# EAGLE design BlueBird_Sch (EAGLE 9.6.2)
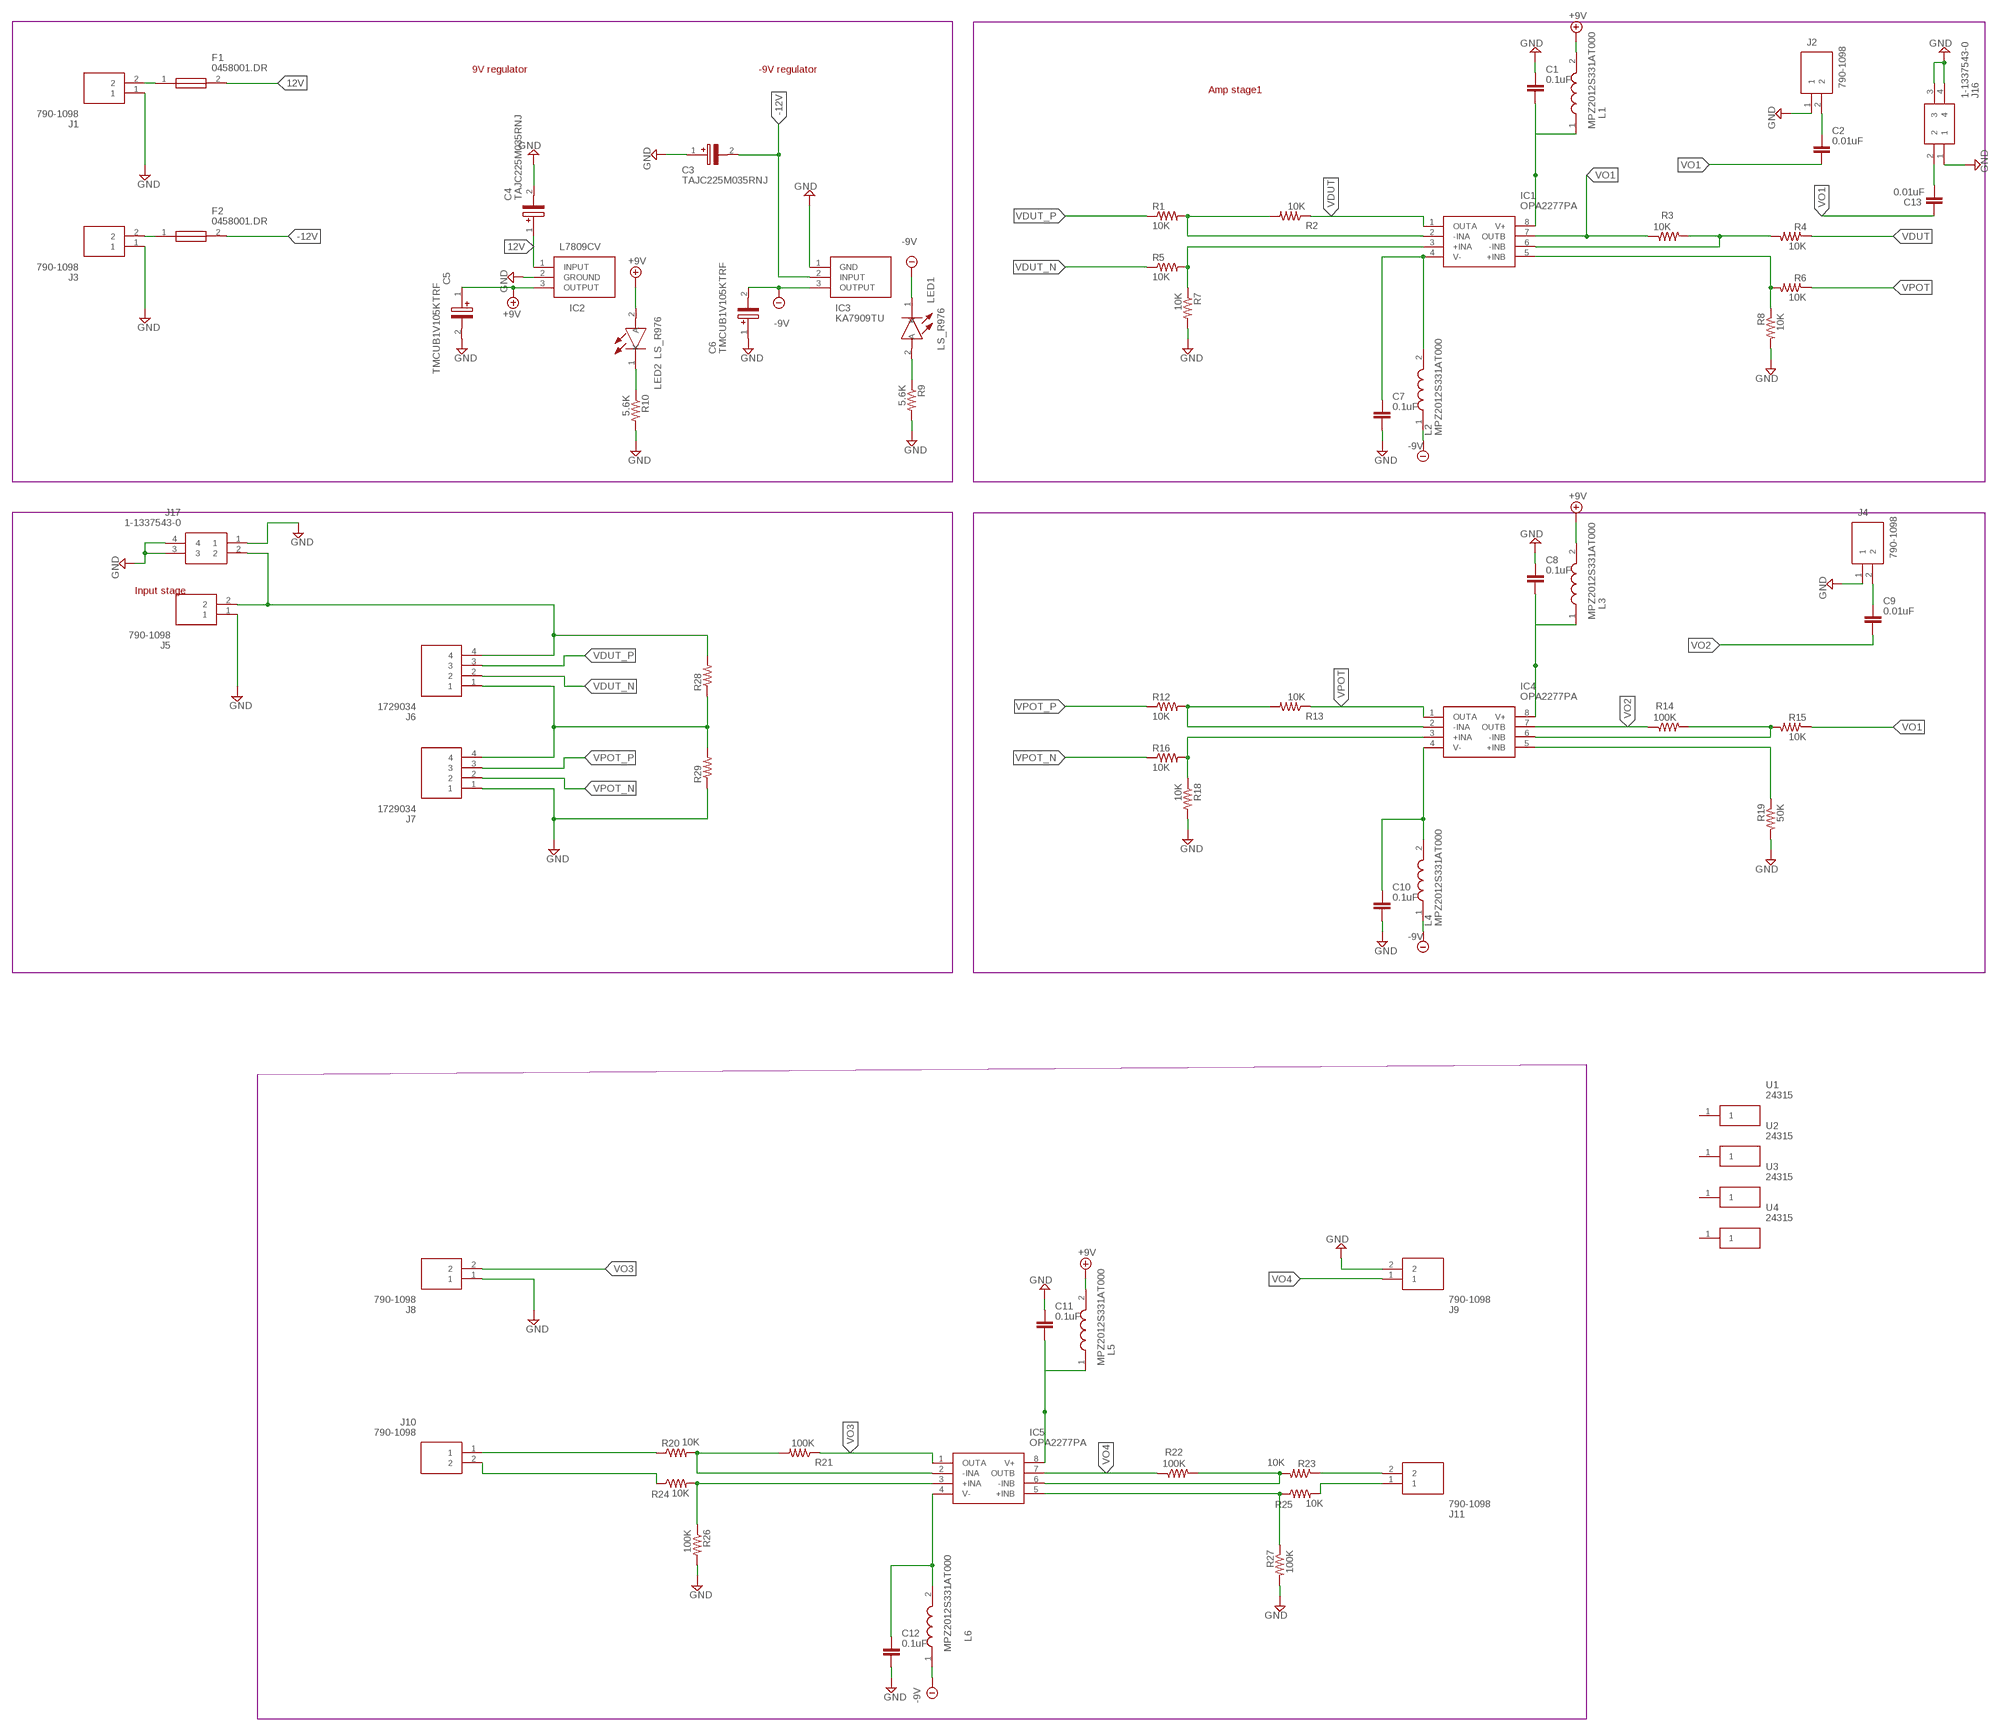
[diagram p0: schematic, sheet 1]

## Parts
C1  0.1uF  C_CHIP-0805(2012-METRIC)  [CAPC2012X110]
C2  0.01uF  C_CHIP-0805(2012-METRIC)  [CAPC2012X110]
C3  TAJC225M035RNJ  [CAPPM6032X280N]
C4  TAJC225M035RNJ  [CAPPM6032X280N]
C5  TMCUB1V105KTRF  [CAPPM3528X120N]
C6  TMCUB1V105KTRF  [CAPPM3528X120N]
C7  0.1uF  C_CHIP-0805(2012-METRIC)  [CAPC2012X110]
C8  0.1uF  C_CHIP-0805(2012-METRIC)  [CAPC2012X110]
C9  0.01uF  C_CHIP-0805(2012-METRIC)  [CAPC2012X110]
C10  0.1uF  C_CHIP-0805(2012-METRIC)  [CAPC2012X110]
C11  0.1uF  C_CHIP-0805(2012-METRIC)  [CAPC2012X110]
C12  0.1uF  C_CHIP-0805(2012-METRIC)  [CAPC2012X110]
C13  0.01uF  C_CHIP-0805(2012-METRIC)  [CAPC2012X110]
F1  0458001.DR  [FUSC3215X58N]
F2  0458001.DR  [FUSC3215X58N]
IC1  OPA2277PA  [DIP794W53P254L959H508Q8N]
IC2  L7809CV  [TO255P460X1020X2008-3P]
IC3  KA7909TU  [TO254P470X1016X2019-3P]
IC4  OPA2277PA  [DIP794W53P254L959H508Q8N]
IC5  OPA2277PA  [DIP794W53P254L959H508Q8N]
J1  790-1098  [7901098]
J2  790-1098  [7901098]
J3  790-1098  [7901098]
J4  790-1098  [7901098]
J5  790-1098  [7901098]
J6  1729034  [SHDR4W110P0X500_1X4_2000X810X1]
J7  1729034  [SHDR4W110P0X500_1X4_2000X810X1]
J8  790-1098  [7901098]
J9  790-1098  [7901098]
J10  790-1098  [7901098]
J11  790-1098  [7901098]
J16  1-1337543-0  [1-1337543-0]
J17  1-1337543-0  [1-1337543-0]
L1  MPZ2012S331AT000  [INDC2012X105N]
L2  MPZ2012S331AT000  [INDC2012X105N]
L3  MPZ2012S331AT000  [INDC2012X105N]
L4  MPZ2012S331AT000  [INDC2012X105N]
L5  MPZ2012S331AT000  [INDC2012X105N]
L6  MPZ2012S331AT000  [INDC2012X105N]
LED1  LS_R976  [LEDC2012X40N]
LED2  LS_R976  [LEDC2012X40N]
R1  10K  R-US_R0805  [R0805]
R2  10K  R-US_R0805  [R0805]
R3  10K  R-US_R0805  [R0805]
R4  10K  R-US_R0805  [R0805]
R5  10K  R-US_R0805  [R0805]
R6  10K  R-US_R0805  [R0805]
R7  10K  R-US_R0805  [R0805]
R8  10K  R-US_R0805  [R0805]
R9  5.6K  R-US_R0805  [R0805]
R10  5.6K  R-US_R0805  [R0805]
R12  10K  R-US_R0805  [R0805]
R13  10K  R-US_R0805  [R0805]
R14  100K  R-US_R0805  [R0805]
R15  10K  R-US_R0805  [R0805]
R16  10K  R-US_R0805  [R0805]
R18  10K  R-US_R0805  [R0805]
R19  50K  R-US_R0805  [R0805]
R20  10K  R-US_R0805  [R0805]
R21  100K  R-US_R0805  [R0805]
R22  100K  R-US_R0805  [R0805]
R23  10K  R-US_R0805  [R0805]
R24  10K  R-US_R0805  [R0805]
R25  10K  R-US_R0805  [R0805]
R26  100K  R-US_R0805  [R0805]
R27  100K  R-US_R0805  [R0805]
R28  R-US_R1206  [R1206]
R29  R-US_R1206  [R1206]
U1  24315  [24315]
U2  24315  [24315]
U3  24315  [24315]
U4  24315  [24315]

## Nets
12V: C4.1(+) F1.2 IC2.1(INPUT)
+9V: C5.1(+) IC2.3(OUTPUT) L1.2 L3.2 L5.2 LED2.2(A)
-9V: C6.2(-) IC3.3(OUTPUT) L2.1 L4.1 L6.1 LED1.1(K)
-12V: C3.2(-) F2.2 IC3.2(INPUT)
GND: C1.1 C3.1(+) C4.2(-) C5.2(-) C6.1(+) C7.2 C8.1 C10.2 C11.1 C12.2 IC2.2(GROUND) IC3.1(GND) J1.1 J2.1 J3.1 J4.1 J5.1 J7.1 J8.1 J9.2 J16.1 J16.3 J16.4 J17.1 J17.3 J17.4 R7.2 R8.2 R9.2 R10.2 R18.2 R19.2 R26.2 R27.2 R29.1
N$1: F1.1 J1.2
N$2: F2.1 J3.2
N$3: C7.1 IC1.4(V-) L2.2
N$4: J10.2 R24.1
N$5: J10.1 R20.1
N$6: J5.2 J6.4 J17.2 R28.2
N$7: J11.2 R23.1
N$8: J11.1 R25.2
N$9: C9.1 J4.2
N$10: C2.1 J2.2
N$11: LED1.2(A) R9.1
N$12: LED2.1(K) R10.1
N$13: C13.1 J16.2
N$18: J6.1 J7.4 R28.1 R29.2
N$19: IC1.2(-INA) R1.2 R2.2
N$22: IC1.3(+INA) R5.2 R7.1
N$27: C8.2 IC4.8(V+) L3.1
N$33: C1.2 IC1.8(V+) L1.1
N$36: C11.2 IC5.8(V+) L5.1
N$37: IC1.6(-INB) R3.2 R4.2
N$38: IC1.5(+INB) R6.2 R8.1
N$39: C10.1 IC4.4(V-) L4.2
N$40: IC4.2(-INA) R12.2 R13.2
N$42: IC4.3(+INA) R16.2 R18.1
N$43: C12.1 IC5.4(V-) L6.2
N$44: IC4.6(-INB) R14.2 R15.2
N$45: IC4.5(+INB) R19.1
N$46: IC5.2(-INA) R20.2 R21.2
N$47: IC5.3(+INA) R24.2 R26.1
N$48: IC5.6(-INB) R22.2 R23.2
N$49: IC5.5(+INB) R25.1 R27.1
VDUT: IC1.1(OUTA) R2.1 R4.1
VDUT_N: J6.2 R5.1
VDUT_P: J6.3 R1.1
VO1: C2.2 C13.2 IC1.7(OUTB) R3.1 R15.1
VO2: C9.2 IC4.7(OUTB) R14.1
VO3: IC5.1(OUTA) J8.2 R21.1
VO4: IC5.7(OUTB) J9.1 R22.1
VPOT: IC4.1(OUTA) R6.1 R13.1
VPOT_N: J7.2 R16.1
VPOT_P: J7.3 R12.1
Unconnected: U1.1 U2.1 U3.1 U4.1

## Notes on the sheet
- 9V regulator | -9V regulator
- Amp stage1
- Input stage

## Library data of the parts
C1 C2 C7-C13 = Capacitor:C: Capacitor - Generic; CATEGORY: Capacitor
C3 C4 = SamacSys_Parts:TAJC225M035RNJ: Tantalum Capacitors - Solid SMD 35volts 2.2uF 20% Source: Datasheet <http://uk.rs-online.com/web/p/products/1364458P>; DESCRIPTION: Tantalum Capacitors - Solid SMD 35volts 2.2uF 20%; HEIGHT: 2.8mm; MANUFACTURER_NAME: AVX; MANUFACTURER_PART_NUMBER: TAJC225M035RNJ; RS_PART_NUMBER: 1364458P; RS_PRICE-STOCK: http://uk.rs-online.com/web/p/products/1364458P
C5 C6 = SamacSys_Parts:TMCUB1V105KTRF: Cap Tant Solid 1uF 35V UB CASE 10% (3.5 X 2.8 X 1.2mm) Inward L SMD 3528-12 8.8 Ohm 125C T/R Source: Datasheet <http://uk.rs-online.com/web/p/products/1882061>; DESCRIPTION: Cap Tant Solid 1uF 35V UB CASE 10% (3.5 X 2.8 X 1.2mm) Inward L SMD 3528-12 8.8 Ohm 125C T/R; HEIGHT: 1.2mm; MANUFACTURER_NAME: Vishay; MANUFACTURER_PART_NUMBER: TMCUB1V105KTRF; RS_PART_NUMBER: 1882061; RS_PRICE-STOCK: http://uk.rs-online.com/web/p/products/1882061
F1 F2 = SamacSys_Parts:0458001.DR: LITTELFUSE - 0458001.DR - Fuse, Surface Mount, 1 A, 48 VAC, 63 VDC, Very Fast Acting, 1206 Source: Datasheet <https://rs.componentsearchengine.com/Datasheets/2/0458001.DR.pdf>; DESCRIPTION: LITTELFUSE - 0458001.DR - Fuse, Surface Mount, 1 A, 48 VAC, 63 VDC, Very Fast Acting, 1206; HEIGHT: 0.58mm; MANUFACTURER_NAME: LITTELFUSE; MANUFACTURER_PART_NUMBER: 0458001.DR
IC1 IC4 IC5 = SamacSys_Parts:OPA2277PA: Dual precision op-amp,OPA2277PA DIP8 Texas Instruments OPA2277PA, Dual Op Amp, 1MHz, 8-Pin PDIP Source: Datasheet <http://uk.rs-online.com/web/p/products/3071673P>; DESCRIPTION: Dual precision op-amp,OPA2277PA DIP8 Texas Instruments OPA2277PA, Dual Op Amp, 1MHz, 8-Pin PDIP; HEIGHT: 5.08mm; MANUFACTURER_NAME: Texas Instruments; MANUFACTURER_PART_NUMBER: OPA2277PA; RS_PART_NUMBER: 3071673P; RS_PRICE-STOCK: http://uk.rs-online.com/web/p/products/3071673P
IC2 = SamacSys_Parts:L7809CV: Standard Regulator 9V 1.5A STMicroelectronics L7809CV, Single Linear Voltage Regulator, 1.5A 9 V, 2%, 3-Pin TO-220 Source: Datasheet <http://uk.rs-online.com/web/p/products/7140666P>; ALLIED_NUMBER: 70013895; DESCRIPTION: Standard Regulator 9V 1.5A STMicroelectronics L7809CV, Single Linear Voltage Regulator, 1.5A 9 V, 2%, 3-Pin TO-220; HEIGHT: 4.6mm; MANUFACTURER_NAME: STMicroelectronics; MANUFACTURER_PART_NUMBER: L7809CV; RS_PART_NUMBER: 7140666P; RS_PRICE-STOCK: http://uk.rs-online.com/web/p/products/7140666P
IC3 = SamacSys_Parts:KA7909TU: ON Semiconductor, -9 V Linear Voltage Regulator, 1A, 1-Channel Negative, +/-4% 3-Pin, TO-220 KA7909TU Source: Datasheet <http://uk.rs-online.com/web/p/products/7390552P>; DESCRIPTION: ON Semiconductor, -9 V Linear Voltage Regulator, 1A, 1-Channel Negative, +/-4% 3-Pin, TO-220 KA7909TU; HEIGHT: 4.7mm; MANUFACTURER_NAME: ON Semiconductor; MANUFACTURER_PART_NUMBER: KA7909TU; RS_PART_NUMBER: 7390552P; RS_PRICE-STOCK: http://uk.rs-online.com/web/p/products/7390552P
J1-J5 J8-J11 = SamacSys_Parts:790-1098: 2 Way PCB Terminal Strip Source: Datasheet; DESCRIPTION: 2 Way PCB Terminal Strip; HEIGHT: 8.5mm; MANUFACTURER_NAME: RS Components; MANUFACTURER_PART_NUMBER: 790-1098
J6 J7 = SamacSys_Parts:1729034: Low profile PCB terminal block,5mm,4 way Phoenix Contact COMBICON MKDSN Series 5mm Pitch Straight PCB Terminal Block with Screw Termination, Through Hole, 4 Way Source: Datasheet <http://uk.rs-online.com/web/p/products/8020620>; ALLIED_NUMBER: 70054377; DESCRIPTION: Low profile PCB terminal block,5mm,4 way Phoenix Contact COMBICON MKDSN Series 5mm Pitch Straight PCB Terminal Block with Screw Termination, Through Hole, 4 Way; HEIGHT: 10mm; MANUFACTURER_NAME: Phoenix Contact; MANUFACTURER_PART_NUMBER: 1729034; RS_PART_NUMBER: 8020620; RS_PRICE-STOCK: http://uk.rs-online.com/web/p/products/8020620
J16 J17 = SamacSys_Parts:1-1337543-0: BNC Ins R/A PCB Skt 50Ohm White Source: Datasheet <http://uk.rs-online.com/web/p/products/5121225P>; ALLIED_NUMBER: 70084602; DESCRIPTION: BNC Ins R/A PCB Skt 50Ohm White; HEIGHT: mm; MANUFACTURER_NAME: TE Connectivity; MANUFACTURER_PART_NUMBER: 1-1337543-0; RS_PART_NUMBER: 5121225P; RS_PRICE-STOCK: http://uk.rs-online.com/web/p/products/5121225P
L1-L6 = SamacSys_Parts:MPZ2012S331AT000: Ferrite Beads Multi-Layer Power 330Ohm 25% 100MHz 2.5A 50mOhm DCR 0805 T/R Source: Datasheet <https://product.tdk.com/info/en/catalog/datasheets/beads_commercial_power_mpz2012_en.pdf>; DESCRIPTION: Ferrite Beads Multi-Layer Power 330Ohm 25% 100MHz 2.5A 50mOhm DCR 0805 T/R; HEIGHT: 1.05mm; MANUFACTURER_NAME: TDK; MANUFACTURER_PART_NUMBER: MPZ2012S331AT000
LED1 LED2 = SamacSys_Parts:LS_R976: Red 0805 CHIPLED LS R976N-R102 Osram Opto LS R976, CHIPLED 0805 Series Red LED, 633 nm, 2012 (0805), Rectangle Lens SMD Package Source: Datasheet <http://uk.rs-online.com/web/p/products/4974804P>; DESCRIPTION: Red 0805 CHIPLED LS R976N-R102 Osram Opto LS R976, CHIPLED 0805 Series Red LED, 633 nm, 2012 (0805), Rectangle Lens SMD Package; HEIGHT: 0.4mm; MANUFACTURER_NAME: OSRAM; MANUFACTURER_PART_NUMBER: LS R976; RS_PART_NUMBER: 4974804P; RS_PRICE-STOCK: http://uk.rs-online.com/web/p/products/4974804P
R1-R10 R12-R16 R18-R29 = resistor:R-US_: RESISTOR, American symbol
U1-U4 = SamacSys_Parts:24315: SPACER/STANDOFF, HEX, BRASS, 15MM; Standoff Material:Brass; Thread Size - Metric:M3; Thread Size - Imperial:-; Standoff Type:Hex Male-Female; Body Length:15mm; Overall Length:23mm; External Width:5mm; Product Range:Hex Brass Series RoHS Compliant: Yes Source: Datasheet <http://keyelco.com/userAssets/file/M65p76.pdf>; ALLIED_NUMBER: 70182188; DESCRIPTION: SPACER/STANDOFF, HEX, BRASS, 15MM; Standoff Material:Brass; Thread Size - Metric:M3; Thread Size - Imperial:-; Standoff Type:Hex Male-Female; Body Length:15mm; Overall Length:23mm; External Width:5mm; Product Range:Hex Brass Series RoHS Compliant: Yes; HEIGHT: 15mm; MANUFACTURER_NAME: Keystone Electronics; MANUFACTURER_PART_NUMBER: 24315

## Board
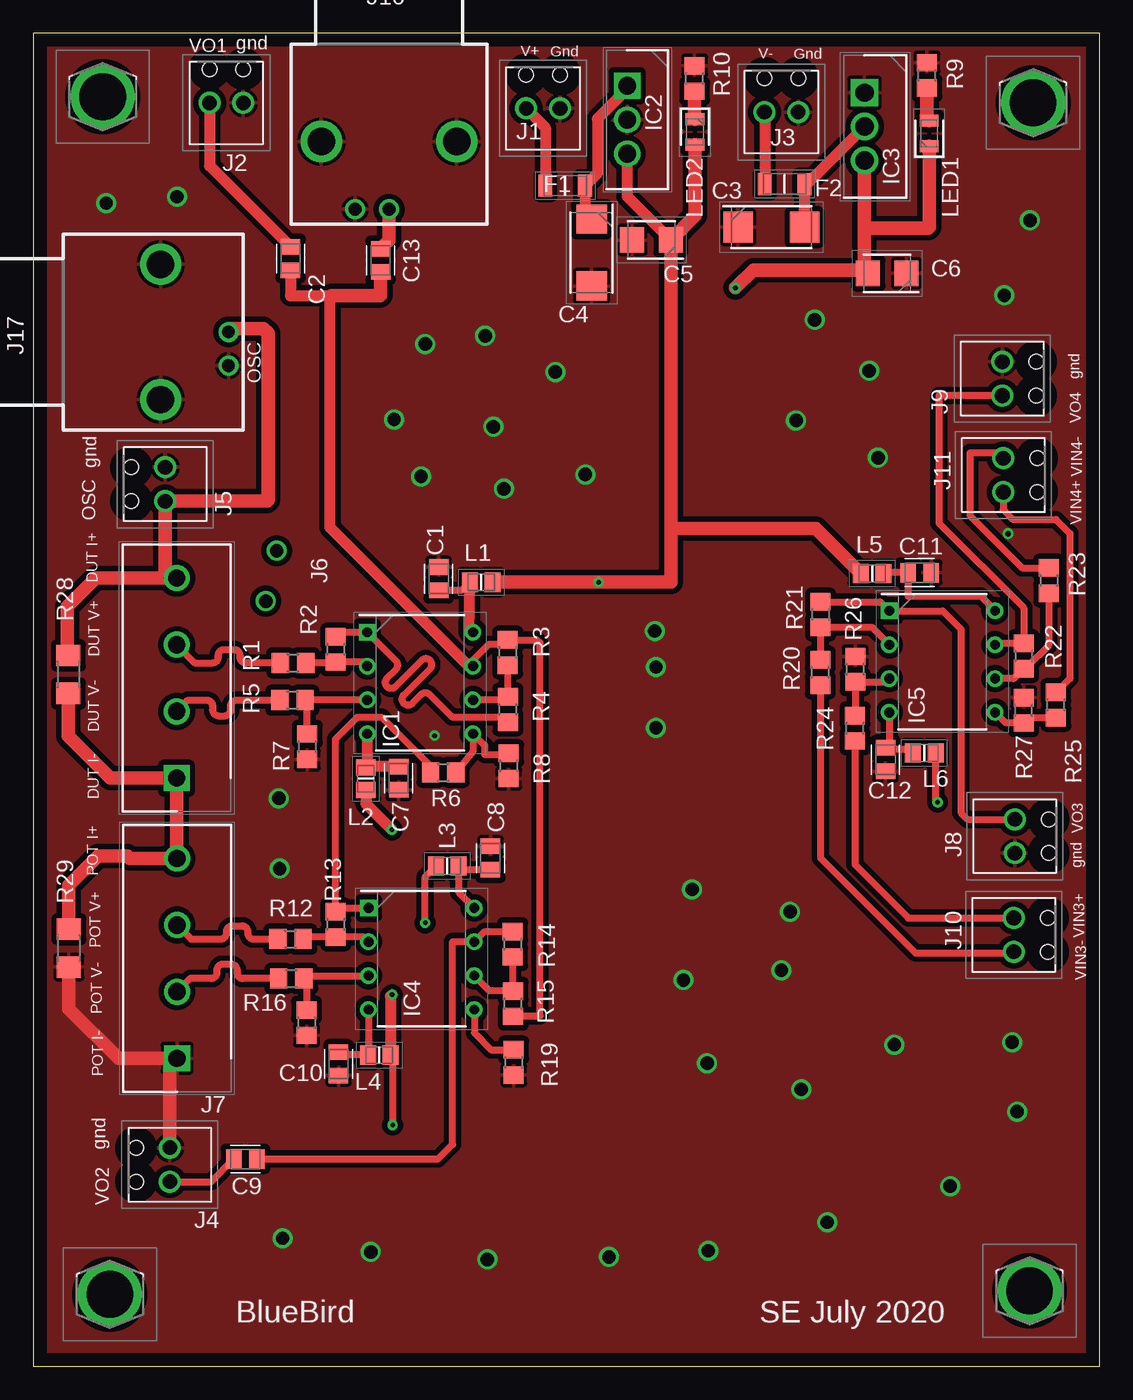
[diagram p1: board, top side]
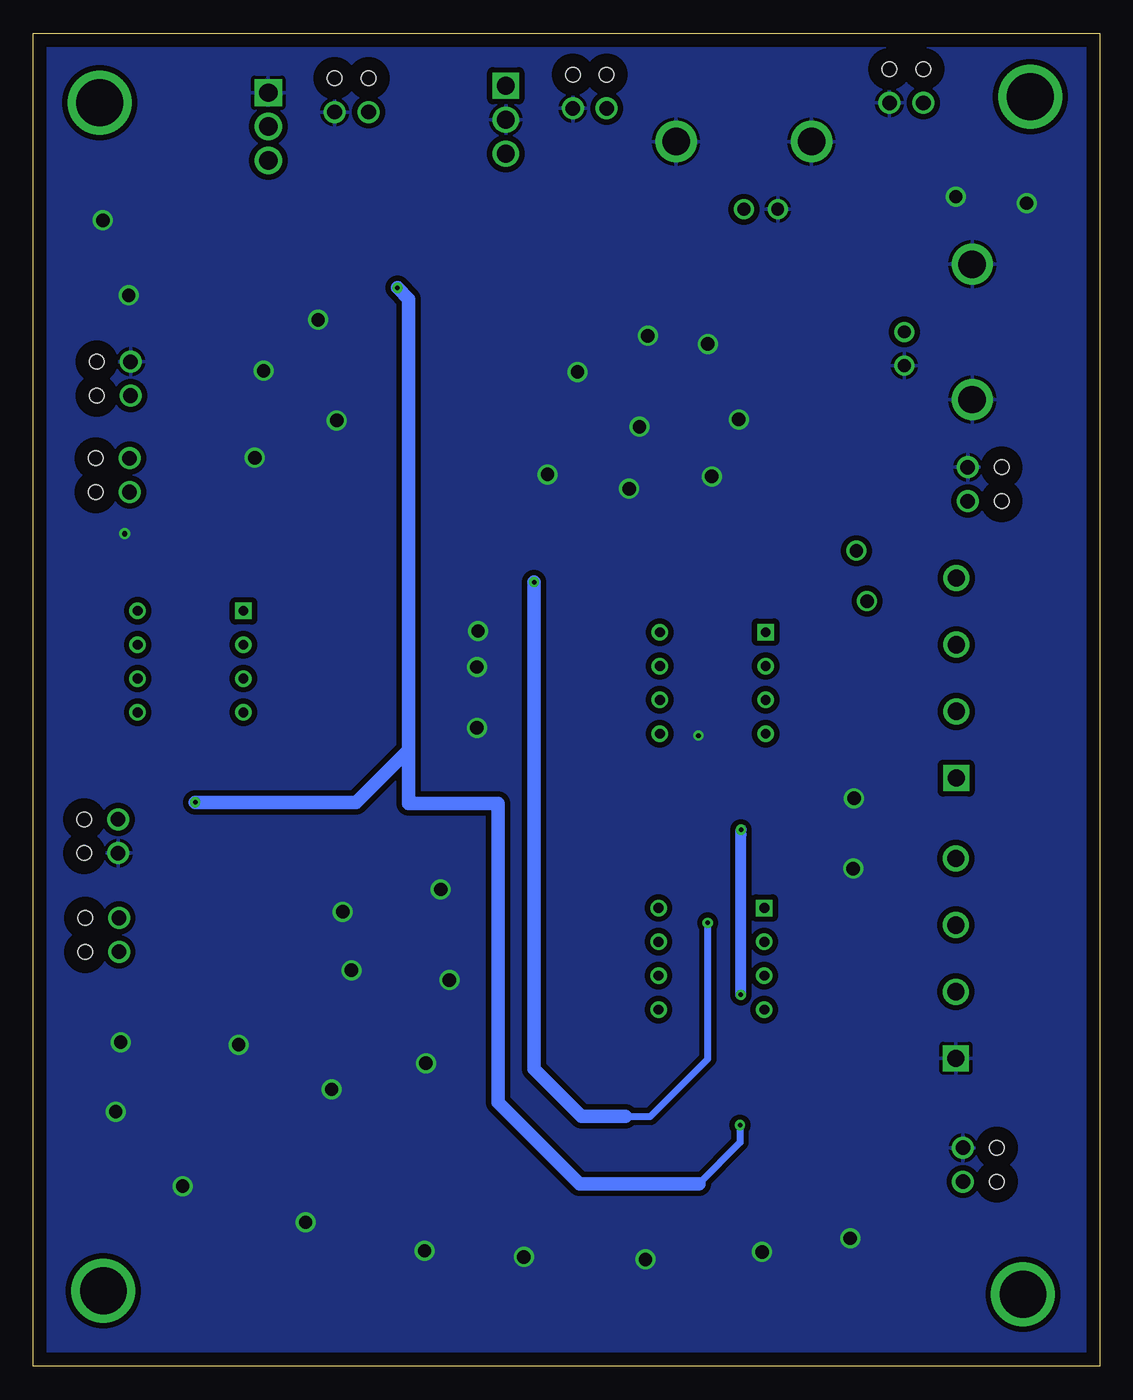
[diagram p2: board, bottom side, seen from below]

Size 80 x 100 mm. Coordinates in mm from the lower left corner, seen from the top.
Outline: 0,0 80,0 80,100 0,100 0,0
Copper layers (1*16): Top 0.07mm / dielectric 1.5mm / Bottom 0.07mm
Design rules "default *": minimum track width 6mil, minimum drill 0.35mm, track to track 6mil, track to pad 6mil, pad to pad 6mil, via to via 6mil, smd to smd 6mil, copper to edge 40mil, drill to drill 6mil, minimum pad ring 10mil, minimum via ring 8mil, stop-mask expansion 4mil, vias tented up to drill 0mil, thermal gap 10mil

### Footprints (pad centres in the part's own frame; a part is rotated, then mirrored left to right if it is on the bottom)
CAPC2012X110 = smd 1.165 x 1.465: 1 -0.875,0; 2 0.875,0
CAPPM6032X280N = smd 2.2 x 2.3: 1 -2.5,0; 2 2.5,0
CAPPM3528X120N = smd 1.8 x 1.9: 1 -1.45,0; 2 1.45,0
FUSC3215X58N = smd 1.02 x 1.63: 1 -1.485,0; 2 1.485,0
DIP794W53P254L959H508Q8N = drill 0.73 pad 1.13 square: 1 -3.97,3.81 | drill 0.73 pad 1.13: 2 -3.97,1.27; 3 -3.97,-1.27; 4 -3.97,-3.81; 5 3.97,-3.81; 6 3.97,-1.27; 7 3.97,1.27; 8 3.97,3.81
TO255P460X1020X2008-3P = drill 1.32 pad 1.98 square: 1 0,0 | drill 1.32 pad 1.98: 2 2.55,0; 3 5.1,0
TO254P470X1016X2019-3P = drill 1.37 pad 2.055 square: 1 0,0 | drill 1.37 pad 2.055: 2 2.535,0; 3 5.07,0
7901098 = drill 1.1 pad 1.65: 1 0,0; 2 2.54,0 | hole 1.1: 0,-2.54; 2.54,-2.54
SHDR4W110P0X500_1X4_2000X810X1 = drill 1.3 pad 1.95 square: 1 0,0 | drill 1.3 pad 1.95: 2 5,0; 3 10,0; 4 15,0
1-1337543-0 = drill 0.97 pad 1.5: 1 -2.54,1.112; 2 0,1.112 | drill 2.06 pad 3.1: 3 5.08,6.2; 4 -5.08,6.2
INDC2012X105N = smd 1.2 x 1.45: 1 -0.85,0; 2 0.85,0
LEDC2012X40N = smd 0.9 x 1.4: 1 -0.95,0; 2 0.95,0
R0805 = smd 1.3 x 1.5: 1 -0.95,0; 2 0.95,0
R1206 = smd 1.6 x 1.803: 1 -1.422,0; 2 1.422,0
24315 = drill 3.5 pad 4.8: 1 0,0

### Placement (x,y rotation side)
C1  30.42,59.08 270 top
C2  19.3,83.1 270 top
C3  55.38,85.46 0 top
C4  41.89,83.55 270 top
C5  46.38,84.5 180 top
C6  64.07,82 180 top
C7  27.41,44.11 270 top
C8  34.3,38.12 270 top
C9  15.91,15.54 0 top
C10  22.9,22.68 270 top
C11  66.5,59.53 180 top
C12  63.94,45.51 270 top
C13  26.06,82.96 270 top
F1  39.91,88.57 0 top
F2  56.37,88.69 0 top
IC1  29.02,51.26 0 top
IC2  44.55,96.07 270 top
IC3  62.37,95.54 270 top
IC4  29.12,30.57 0 top
IC5  68.2,52.86 0 top
J1  39.52,94.37 180 top
J2  15.76,94.78 180 top
J3  57.39,94.1 180 top
J4  10.24,16.39 270 top
J5  9.89,67.44 270 top
J6  10.75,44.13 90 top
J7  10.78,23.1 90 top
J8  73.64,38.49 90 top
J9  72.7,72.82 90 top
J10  73.57,31.09 90 top
J11  72.78,65.58 90 top
J16  26.69,85.68 0 top
J17  15.75,77.6 90 top
L1  33.6,58.82 0 top
L2  24.96,44.08 90 top
L3  31.06,37.53 180 top
L4  25.95,23.34 180 top
L5  62.94,59.47 180 top
L6  66.85,46.01 180 top
LED1  67.22,92.49 90 top
LED2  49.64,92.61 270 top
R1  19.49,52.76 0 top
R2  22.69,53.78 270 top
R3  35.59,53.55 270 top
R4  35.61,49.27 90 top
R5  19.44,49.97 0 top
R6  30.75,44.56 0 top
R7  20.55,46.48 270 top
R8  35.67,45.04 270 top
R9  67.05,96.85 90 top
R10  49.62,96.61 90 top
R12  19.29,32.04 0 top
R13  22.69,33.15 270 top
R14  35.97,31.66 270 top
R15  36,27.2 90 top
R16  19.36,29.08 0 top
R18  20.5,25.77 270 top
R19  36.04,22.79 270 top
R20  59.05,52.05 90 top
R21  59.06,56.4 270 top
R22  74.3,53.28 270 top
R23  76.18,58.95 270 top
R24  61.65,47.86 90 top
R25  76.73,49.61 90 top
R26  61.67,52.29 90 top
R27  74.3,49.21 90 top
R28  2.63,51.9 90 top
R29  2.66,31.37 90 top
U1  5.74,5.4 0 top
U2  74.75,5.66 0 top
U3  75.02,94.8 0 top
U4  5.2,95.24 0 top

### Tracks (layer width: path | path; a pad name or v marks a point on that pad's centre or on a via)
12V
  Top 0.813: IC2.1 44.55,95.81 42.31,93.58 42.31,89.49 F1.2 41.4,86.11 C4.1
+9V  (via drill 0.35)
  Top 0.508: v29.4,33.27 29.4,36.72 L3.2
  Top 0.813: C5.1 44.55,87.78 IC2.3
  Top 1.016: LED2.2 49.64,86.31 C5.1 47.83,62.85 | 47.83,62.85 47.83,58.82 v42.42,58.82 L1.2 | L5.2 58.71,62.85 47.83,62.85
  Bottom 0.508: 35.56,18.74 33.7,18.74 29.4,23.04 v29.4,33.27
  Bottom 1.016: v42.42,58.82 42.42,22.3 38.86,18.74 35.56,18.74
-9V  (via drill 0.35)
  Top 0.508: v67.85,42.31 67.7,42.46 L6.1 | L4.1 26.97,23.17 v26.97,18.09
  Top 0.813: L2.1 24.96,42.19 v26.9,40.25 | v26.92,27.87 26.8,27.75 L4.1
  Top 1.016: IC3.3 62.37,85.55 | 62.37,85.55 62.37,82.25 | 62.37,82.25 C6.2 | 62.37,85.55 62.53,85.39 67.14,85.39 67.22,85.47 LED1.1 | v52.68,80.9 54.03,82.25 62.37,82.25
  Bottom 0.508: v26.97,18.09 26.97,16.79 30.07,13.69
  Bottom 0.813: v26.92,27.87 26.92,39.85 26.9,39.87 v26.9,40.25
  Bottom 1.016: 30.07,13.69 39.01,13.69 45.13,19.81 45.13,42.22 51.83,42.22 51.83,46.25 | v52.68,80.9 51.83,80.05 51.83,46.25 | v67.85,42.31 55.77,42.31 51.83,46.25
-12V
  Top 0.813: IC3.2 58.05,88.69 F2.2 57.85,86.74 C3.2
GND  (via drill 0.35, 0.4, 1)
  Top 0.508: 10.76,23.08 J7.1
  Top 1.016: R29.1 2.66,26.82 6.4,23.08 10.76,23.08 10.24,22.56 J4.1
  other vias: 73.14,62.46 18.71,9.59 25.32,8.57 34.07,8.01 43.19,8.2 50.64,8.66 59.57,10.8 68.79,13.51 73.82,19.09 73.44,24.31 64.6,24.12 57.62,20.77 50.55,22.73 48.78,28.97 49.43,35.77 56.13,29.71 56.78,34.09 46.72,47.89 46.72,52.46 46.63,55.16 41.42,66.91 35.3,65.83 34.52,70.48 27.07,71.03 29.09,66.76 39.17,74.6 29.4,76.69 33.9,77.31 57.23,70.95 63.38,68.16 62.72,74.68 58.63,78.51 72.85,80.34 74.78,85.97 5.47,87.26 10.78,87.74 18.48,37.33 18.42,42.61 30.1,47.31
  pour Top (isolate 0.406): -5,105 -5,-10 85,-10 85,105
  pour Bottom (isolate 0.406): -22,102 -22,-12 90,-12 90,102
N$1
  Top 0.813: J1.2 38.42,92.92 F1.1
N$2
  Top 0.813: J3.2 54.88,94.06 F2.1
N$3
  Top 0.813: C7.1 25.02,44.98 | 25.02,44.98 L2.2 | IC1.4 25.05,45.02 25.02,44.98
N$4
  Top 0.508: R24.1 61.65,37.63 65.65,33.63 J10.2
N$5
  Top 0.508: R20.1 59.06,38.12 66.19,30.99 73.47,30.99 J10.1
N$6
  Top 1.016: J6.4 9.83,59.13 | 9.83,59.13 4.69,59.13 2.54,56.98 2.54,53.41 R28.2 | 9.83,59.13 9.89,59.19 J5.2 17.54,64.9 17.61,64.97 17.61,77.49 17.24,77.86 14.9,77.86 J17.2
N$7
  Top 0.508: J11.2 72.78,68.54 70.28,68.54 70.28,63.83 74.2,59.9 R23.1
N$8
  Top 0.508: J11.1 72.77,64.26 73.51,63.52 76.72,63.52 77.77,62.47 77.77,51.58 76.75,50.56 76.75,50.28 R25.2
N$9
  Top 0.508: J4.2 13.35,13.85 C9.1
N$10
  Top 0.813: C2.1 13.22,90.06 J2.2
N$11
  Top 1.016: R9.1 67.05,93.61 LED1.2
N$12
  Top 1.016: R10.1 49.62,93.58 LED2.1
N$13
  Top 1.016: J16.2 26.69,84.47 C13.1
N$14  (via drill 1)
  other vias: 18.25,61.18
N$15  (via drill 1)
  other vias: 17.44,57.4
N$18
  Top 1.016: R28.1 2.63,47.27 5.77,44.13 J6.1 10.75,38.13 J7.4 7.22,38.1 7.04,38.28 4.88,38.28 2.66,36.06 R29.2
N$19
  Top 0.508: 22.62,52.76 R1.2 | R2.2 24.75,52.83 IC1.2
  Top 1.016: 22.62,52.76 R2.2
N$22
  Top 0.508: IC1.3 25.03,49.97 R5.2 20.55,49.81 R7.1
N$27
  Top 0.508: C8.2 32.2,37.24 L3.1 31.91,35.56 IC4.8
N$33
  Top 0.508: L1.1 32.13,58.2 C1.2
  Top 0.813: IC1.8 32.71,55.07 L1.1
N$36
  Top 0.508: IC5.8 71.08,57.78 65.62,57.78 C11.2 63.85,59.53 L5.1
N$37
  Top 0.508: IC1.6 35.38,49.99 R4.2 35.59,50.24 R3.2
N$38
  Top 0.508: R6.2 32.99,46.11 IC1.5 33.86,46.58 33.86,45.89 35.57,45.89 R8.1
N$39
  Top 0.508: IC4.4 25.15,23.39 L4.2 23.11,23.34 C10.1
N$40
  Top 0.508: R12.2 20.4,32.2 R13.2 24.79,32.2 IC4.2
N$42
  Top 0.508: R18.1 20.5,28.89 R16.2 20.53,29.3 IC4.3
N$43
  Top 0.508: IC5.4 64.23,46.67 C12.1 64.06,46.27 65.74,46.27 L6.2
N$44
  Top 0.508: 35.97,28.18 R15.2 | IC4.6 34.21,28.18 35.97,28.18 | R14.2 35.97,28.18
N$45
  Top 0.508: IC4.5 33.09,25.01 34.36,23.74 R19.1
N$46
  Top 0.508: IC5.2 62.91,55.45 R21.2 R20.2
N$47
  Top 0.508: IC5.3 63.98,51.34 R26.1 61.67,48.83 R24.2
N$48
  Top 0.508: IC5.6 73.56,51.59 R22.2 74.52,52.41 76.18,54.07 R23.2
N$49
  Top 0.508: R25.1 74.7,48.66 R27.1 72.96,48.26 IC5.5
VDUT
  Top 0.508: R4.1 35.21,48.72 31.4,48.72 29.73,50.39 arc90 29.1,50.39 28.43,49.72 arc-90 27.8,49.72 27.8,49.72 arc-90 27.8,50.35 29.77,52.32 arc90 29.77,52.95 29.77,52.95 arc90 29.14,52.95 27.17,50.98 arc-90 26.54,50.98 26.54,50.99 arc-90 26.54,51.62 27.2,52.29 arc90 27.2,52.91 IC1.1 23.03,55.07 R2.1
VDUT_N
  Top 0.508: J6.2 11.59,49.97 13.01,49.97 arc-90 13.45,49.53 13.45,49.24 arc90 13.89,48.8 14.36,48.8 arc90 14.81,49.24 14.81,49.53 arc-90 15.25,49.97 R5.1
VDUT_P
  Top 0.508: J6.3 12.12,52.76 13.43,52.76 arc90 13.87,53.2 13.87,53.32 arc-90 14.32,53.76 15.06,53.76 arc-90 15.51,53.32 15.51,53.2 arc90 15.95,52.76 R1.1
VO1
  Top 0.508: IC1.7 32.99,52.97 34.15,54.13 35.22,54.13 R3.1 37.79,54.5 38.02,54.27 38.02,26.29 36.04,26.29 R15.1
  Top 0.813: IC1.7 32.65,52.53 22.26,62.92 22.26,80.19 | 26.01,80.31 19.3,80.31 C2.2
  Top 1.016: 22.26,80.19 22.38,80.31 26.01,80.31 26.06,80.36 C13.2
VO2
  Top 0.508: C9.2 30.36,15.54 31.46,16.64 31.46,31.86 33.07,31.86 IC4.7 33.86,32.61 R14.1
VO3
  Top 0.508: R21.1 63.55,57.35 IC5.1 68.23,56.67 69.6,55.3 69.6,41.51 70.08,41.03 J8.2
VO4
  Top 0.508: IC5.7 72.33,53.97 72.59,54.23 R22.1 74.3,56.91 67.96,63.25 67.96,72.82 J9.1
VPOT
  Top 0.508: R6.1 29.98,44.84 26.12,48.69 24.32,48.69 22.67,47.04 22.67,35.75 22.69,35.73 R13.1 22.97,34.38 IC4.1
VPOT_N
  Top 0.508: J7.2 11.76,29.08 13.33,29.08 arc90 13.77,29.52 13.77,29.71 arc-90 14.22,30.16 14.85,30.16 arc-90 15.29,29.71 15.29,29.52 arc90 15.74,29.08 R16.1
VPOT_P
  Top 0.508: J7.3 11.84,32.04 14.05,32.04 arc90 14.49,32.48 14.49,32.6 arc-90 14.94,33.04 15.65,33.04 arc-90 16.1,32.6 16.1,32.48 arc90 16.54,32.04 R12.1

### Text on the board
tNames: VO1 | gnd | V+ | Gnd | V- | Gnd | gnd | OSC | VO4 | VIN4- | gnd | VIN4+ | OSC | DUT I+ | DUT V+ | DUT V- | DUT I- | VO3 | gnd | POT I+ | VIN3+ | VIN3- | POT V+ | POT V- | POT I- | gnd | VO2 | BlueBird | SE July 2020